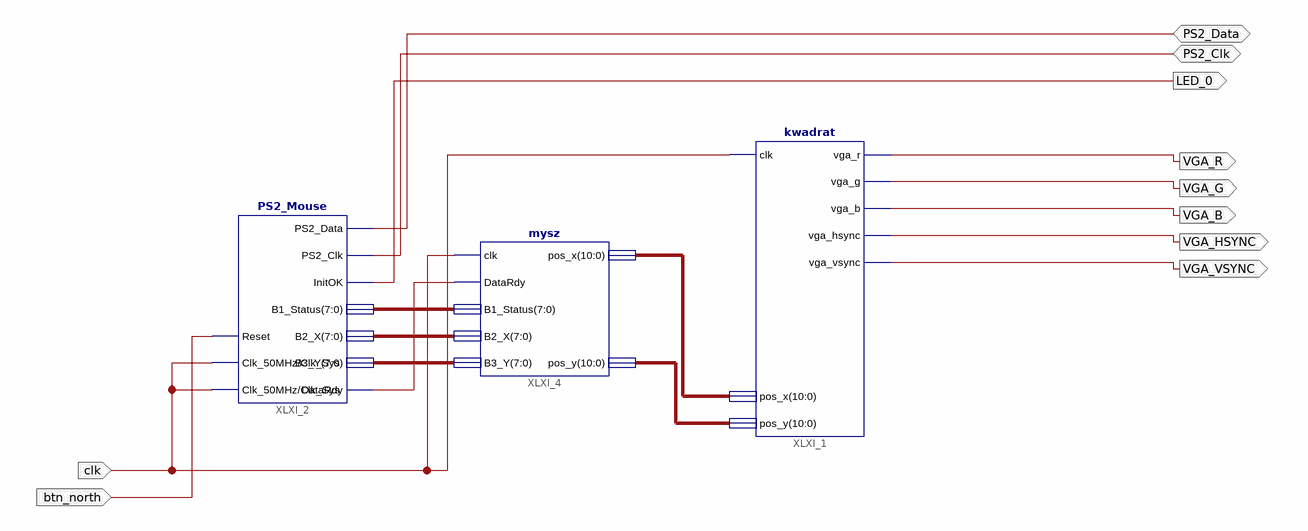
[diagram p0: schematic sheet 1]
// Xilinx ISE schematic kwadrat_sch.sch (spartan3e) as structural Verilog: 3 symbols, 10 ports
module kwadrat_sch (
  input  clk,
  input  btn_north,
  inout  PS2_Data,
  inout  PS2_Clk,
  output VGA_R,
  output VGA_G,
  output VGA_B,
  output VGA_HSYNC,
  output VGA_VSYNC,
  output LED_0
);

  wire XLXN_13;
  wire [7:0] XLXN_10, XLXN_11, XLXN_12;
  wire [10:0] XLXN_14, XLXN_15;

  PS2_Mouse XLXI_2 (
    .PS2_Data(PS2_Data), .PS2_Clk(PS2_Clk), .InitOK(LED_0), .DataRdy(XLXN_13), .B1_Status(XLXN_10),
    .B2_X(XLXN_11), .B3_Y(XLXN_12), .Clk_50MHz(clk), .Reset(btn_north), .Clk_Sys(clk));
  kwadrat XLXI_1 (
    .clk(clk), .pos_x(XLXN_14), .pos_y(XLXN_15), .vga_r(VGA_R), .vga_g(VGA_G), .vga_b(VGA_B),
    .vga_hsync(VGA_HSYNC), .vga_vsync(VGA_VSYNC));
  mysz XLXI_4 (
    .clk(clk), .DataRdy(XLXN_13), .B1_Status(XLXN_10), .B2_X(XLXN_11), .B3_Y(XLXN_12), .pos_x(XLXN_14),
    .pos_y(XLXN_15));
endmodule
